# EAGLE design single44 (EAGLE 6.6.0)
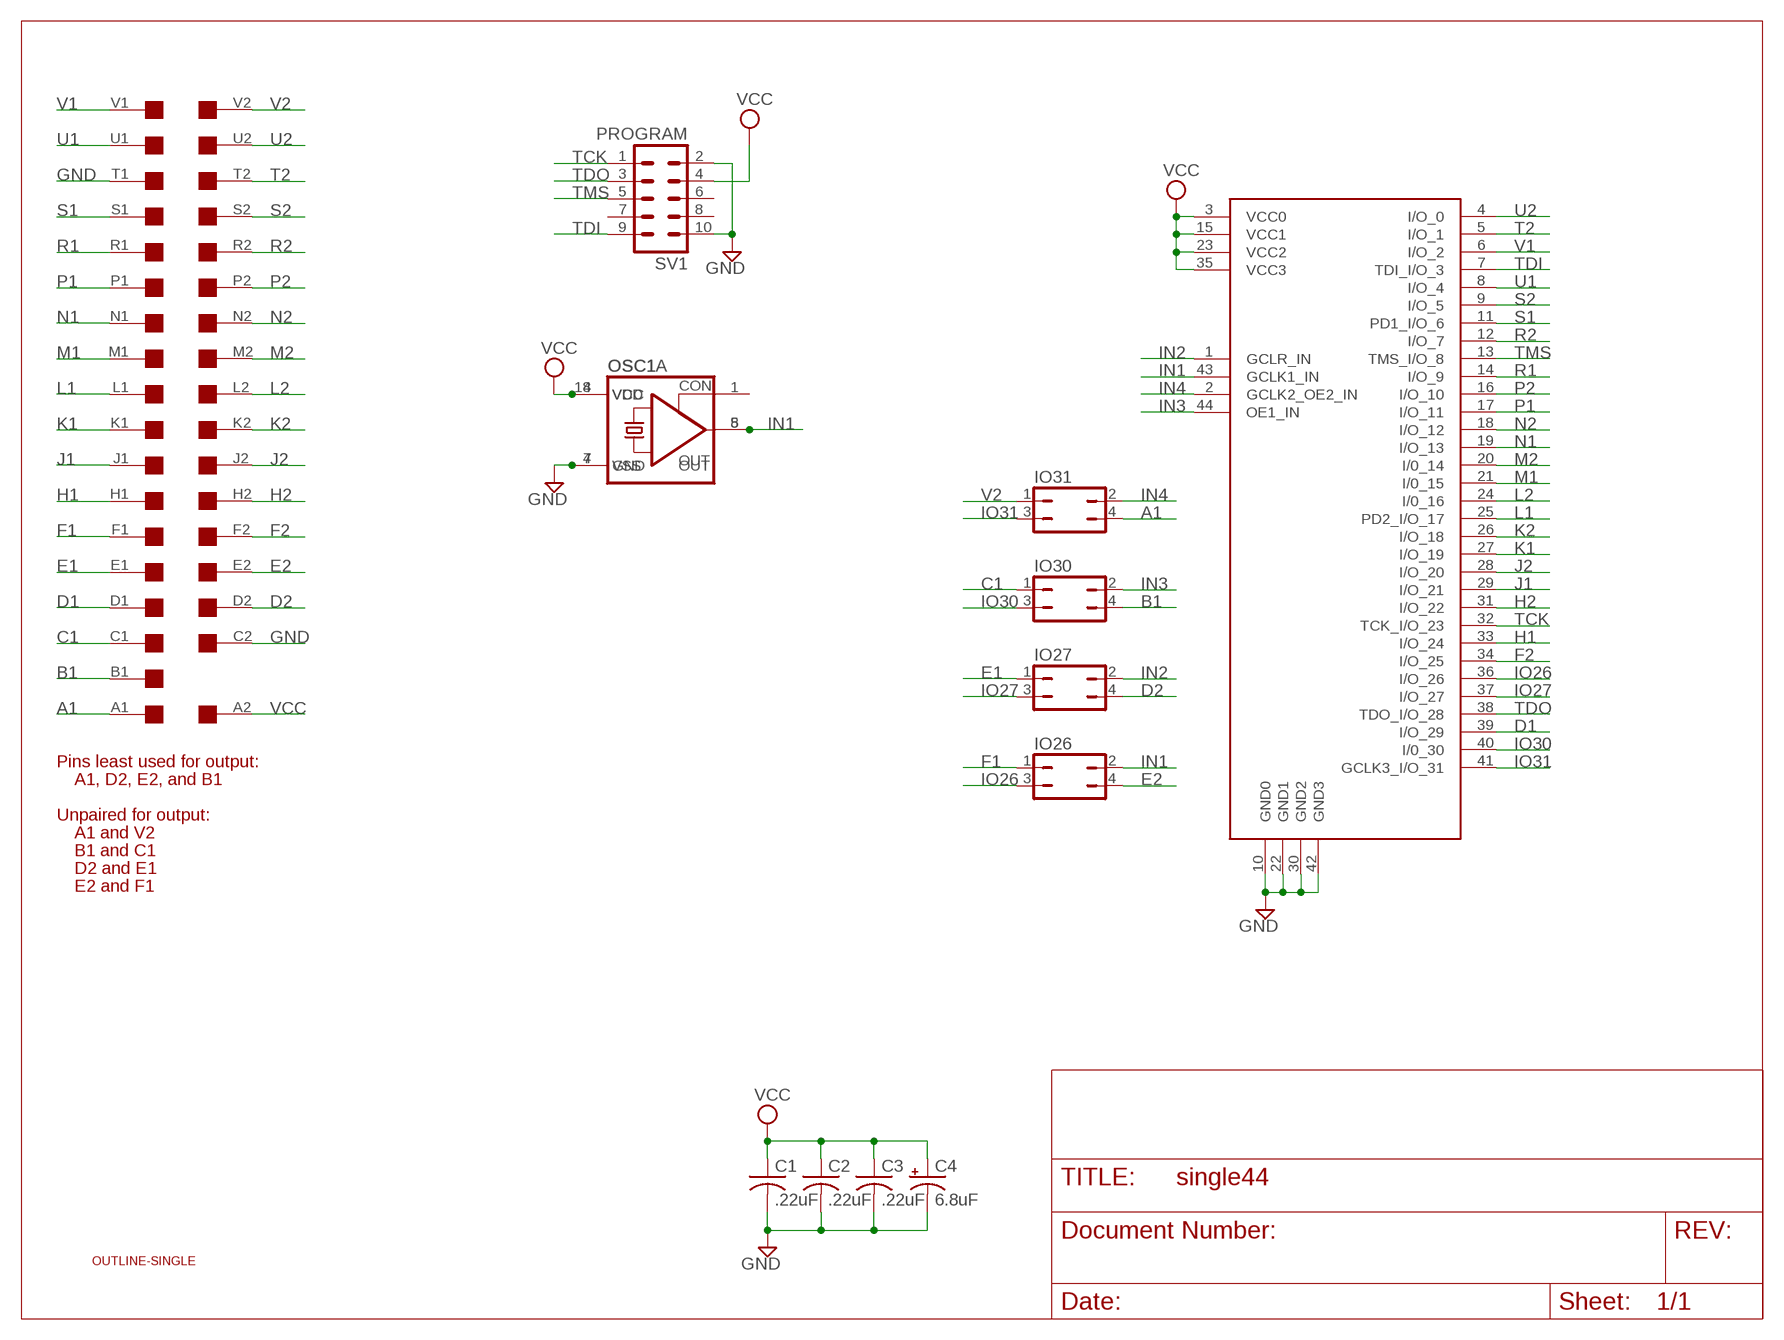
[diagram p0: schematic, sheet 1]

## Parts
C1  .22uF  C-US050-025X075  [C050-025X075]
C2  .22uF  C-US050-025X075  [C050-025X075]
C3  .22uF  C-US050-025X075  [C050-025X075]
C4  6.8uF  CPOL-USE15-5AXIAL  [E15-5]
IO26  JP2Q  [JP2Q]
IO27  JP2Q  [JP2Q]
IO30  JP2Q  [JP2Q]
IO31  JP2Q  [JP2Q]
OSC1  QG5460  [DIL08S]
OSC1A  CRYSTAL_RES-SG51  [SG51]
SV1  PROGRAM  ML10  [ML10]
U1  ATF1504  ATF1502PLCC44  [3M44]
U$1  OUTLINE-SINGLE  [SINGLE]
U$2  SINGLE  [EDGE-CON2]

## Nets
A1: IO31.4 U$2.A1
B1: IO30.4 U$2.B1
C1: IO30.1 U$2.C1
D1: U1.39(I/O_29) U$2.D1
D2: IO27.4 U$2.D2
E1: IO27.1 U$2.E1
E2: IO26.4 U$2.E2
F1: IO26.1 U$2.F1
F2: U1.34(I/O_25) U$2.F2
GND: C1.2 C2.2 C3.2 C4.- OSC1.4(GND) OSC1A.7(VSS) SV1.2 SV1.10 U1.10(GND0) U1.22(GND1) U1.30(GND2) U1.42(GND3) U$2.C2 U$2.T1
H1: U1.33(I/O_24) U$2.H1
H2: U1.31(I/O_22) U$2.H2
IN1: IO26.2 OSC1.5(OUT) OSC1A.8(OUT) U1.43(GCLK1_IN)
IN2: IO27.2 U1.1(GCLR_IN)
IN3: IO30.2 U1.44(OE1_IN)
IN4: IO31.2 U1.2(GCLK2_OE2_IN)
IO26: IO26.3 U1.36(I/O_26)
IO27: IO27.3 U1.37(I/O_27)
IO30: IO30.3 U1.40(I/0_30)
IO31: IO31.3 U1.41(GCLK3_I/O_31)
J1: U1.29(I/O_21) U$2.J1
J2: U1.28(I/O_20) U$2.J2
K1: U1.27(I/O_19) U$2.K1
K2: U1.26(I/O_18) U$2.K2
L1: U1.25(PD2_I/O_17) U$2.L1
L2: U1.24(I/0_16) U$2.L2
M1: U1.21(I/0_15) U$2.M1
M2: U1.20(I/0_14) U$2.M2
N1: U1.19(I/O_13) U$2.N1
N2: U1.18(I/O_12) U$2.N2
P1: U1.17(I/O_11) U$2.P1
P2: U1.16(I/O_10) U$2.P2
R1: U1.14(I/O_9) U$2.R1
R2: U1.12(I/O_7) U$2.R2
S1: U1.11(PD1_I/O_6) U$2.S1
S2: U1.9(I/O_5) U$2.S2
T2: U1.5(I/O_1) U$2.T2
TCK: SV1.1 U1.32(TCK_I/O_23)
TDI: SV1.9 U1.7(TDI_I/O_3)
TDO: SV1.3 U1.38(TDO_I/O_28)
TMS: SV1.5 U1.13(TMS_I/O_8)
U1: U1.8(I/O_4) U$2.U1
U2: U1.4(I/O_0) U$2.U2
V1: U1.6(I/O_2) U$2.V1
V2: IO31.1 U$2.V2
VCC: C1.1 C2.1 C3.1 C4.+ OSC1.8(VCC) OSC1A.14(VDD) SV1.4 U1.3(VCC0) U1.15(VCC1) U1.23(VCC2) U1.35(VCC3) U$2.A2
Unconnected: OSC1A.1(CON) SV1.6 SV1.7 SV1.8 U$2.B2

## Notes on the sheet
- Pins least used for output:
- A1, D2, E2, and B1
- Unpaired for output:
- A1 and V2
- B1 and C1
- D2 and E1
- E2 and F1

## Library data of the parts
C1-C3 = rcl:C-US: CAPACITOR, American symbol
C4 = dec-con:CPOL-USE15-5AXIAL: 0.6" version of an electrolytic
IO26 IO27 IO30 IO31 = jumper:JP2Q: JUMPER
OSC1 = crystal:QG5460: CRYSTAL RESONATOR; OC_FARNELL: unknown; OC_NEWARK: unknown
OSC1A = crystal:CRYSTAL_RES-: CRYSTAL RESONATOR; OC_FARNELL: unknown; OC_NEWARK: unknown
SV1 = con-harting-ml:ML10: HARTING; OC_FARNELL: unknown; OC_NEWARK: unknown
U1 = atmel-cpld:ATF1502: ATF150x in 44 pin package.
U$1 = dec-con:OUTLINE-*: Board outlines for DEC boards.
U$2 = dec-con:SINGLE: Single-Height DEC board

## Net classes
1 Supply: width 0.711 mm

## Board
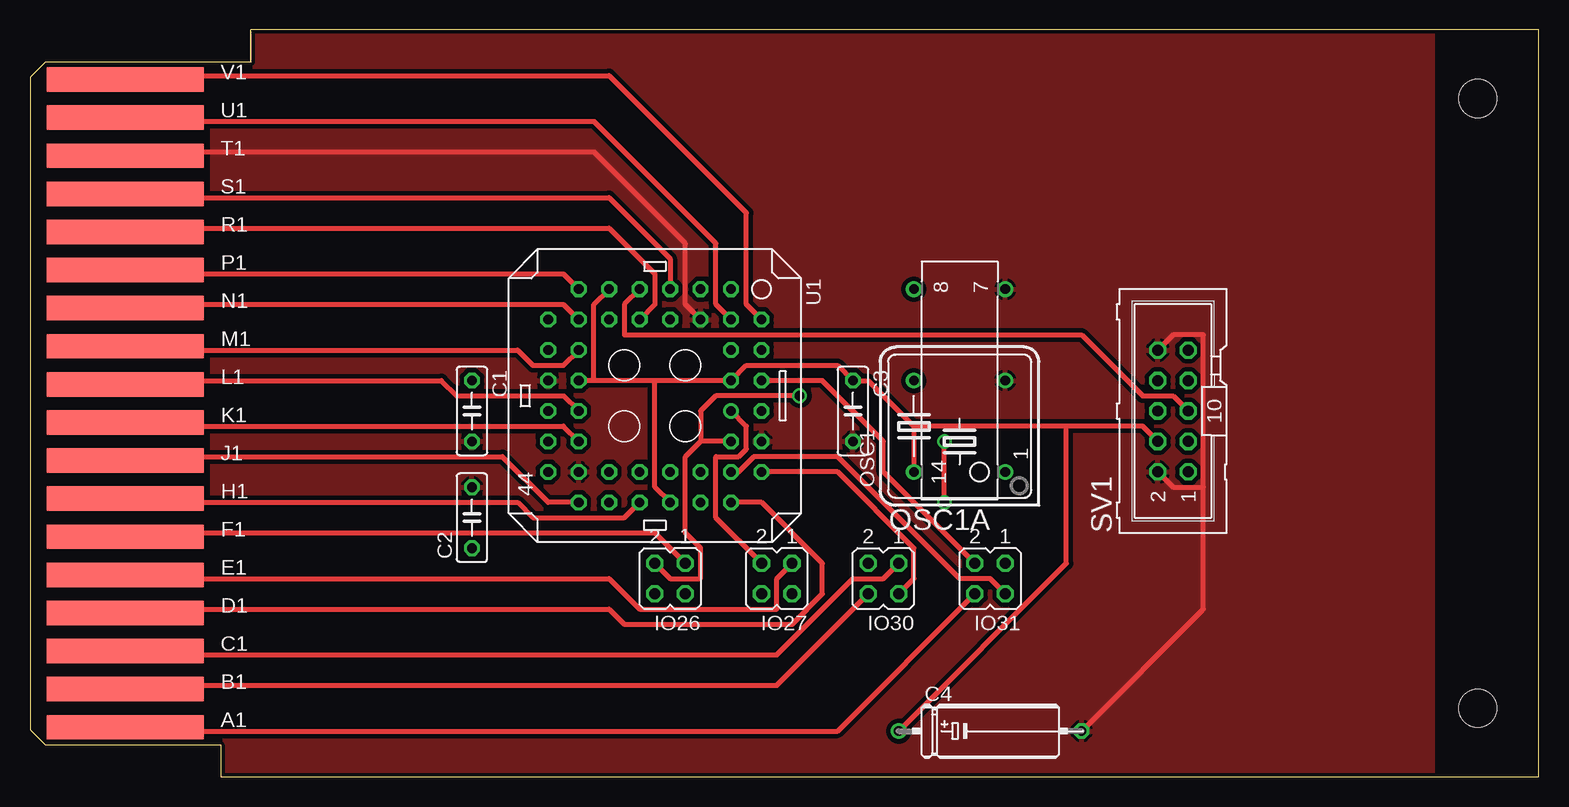
[diagram p1: board, top side]
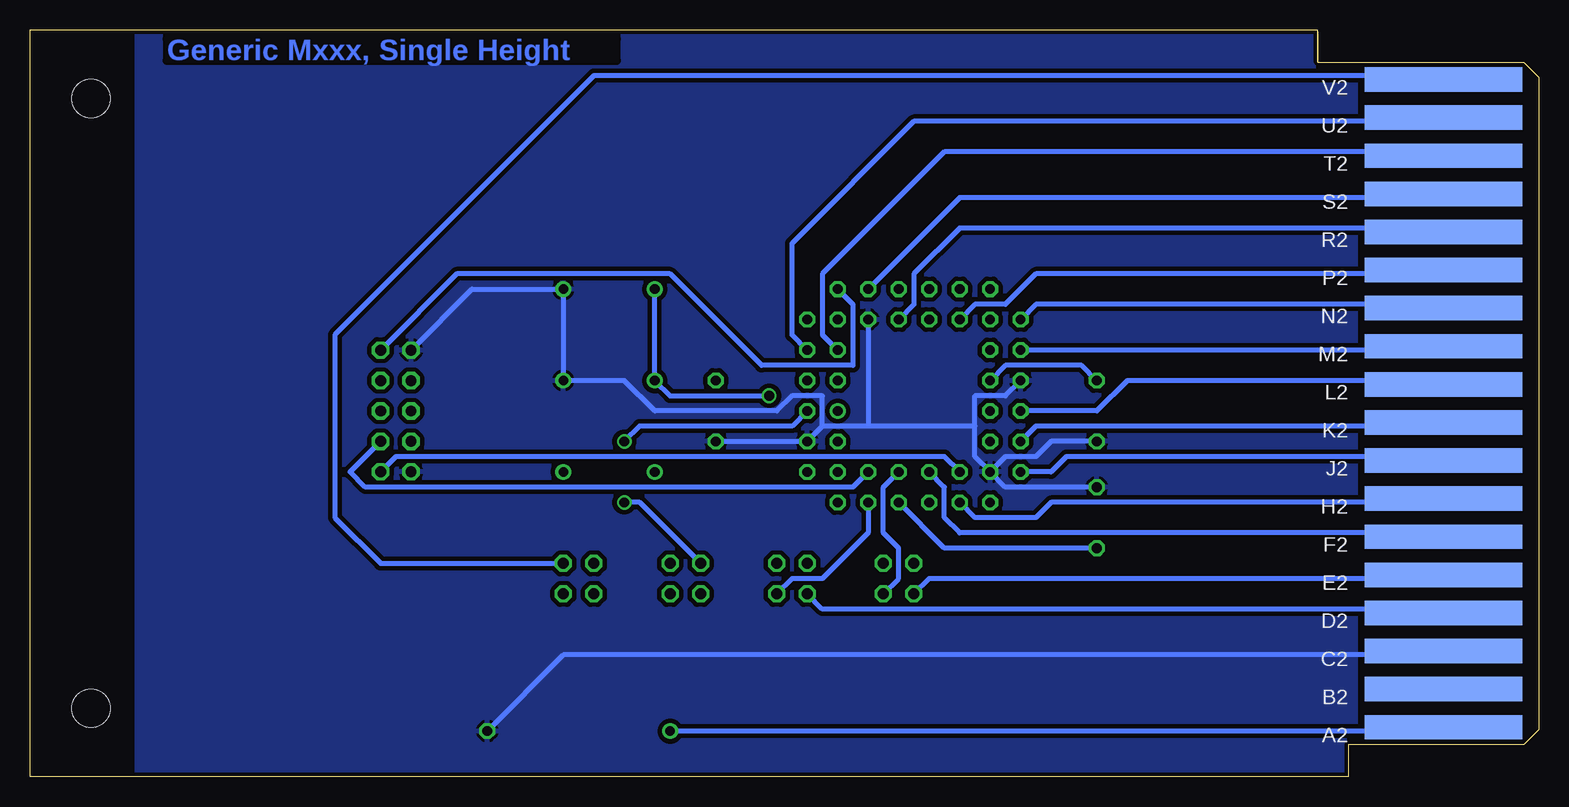
[diagram p2: board, bottom side, seen from below]

Size 125.73 x 62.23 mm. Coordinates in mm from the lower left corner, seen from the top.
Copper layers (1+16): Top 0.035mm / dielectric 1.5mm / Bottom 0.035mm
Design rules "16mils": minimum track width 16mil, minimum drill 32mil, track to track 15mil, track to pad 10mil, pad to pad 10mil, via to via 10mil, smd to smd 10mil, copper to edge 13mil, drill to drill 10mil, minimum pad ring 10mil, minimum via ring 8mil, stop-mask expansion 0mil, vias tented up to drill 0mil, thermal gap 10mil

### Footprints (pad centres in the part's own frame; a part is rotated, then mirrored left to right if it is on the bottom)
C050-025X075 = drill 0.813 octagon: 1 -2.54,0; 2 2.54,0
E15-5 = drill 0.813: + -7.62,0 | drill 0.813 octagon: - 7.62,0
JP2Q = drill 0.914 octagon: 1 -1.27,-1.27; 2 1.27,-1.27; 3 -1.27,1.27; 4 1.27,1.27
DIL08S = drill 0.813: 1 -3.81,-3.81; 4 3.81,-3.81; 5 3.81,3.81; 8 -3.81,3.81
SG51 = drill 0.813: 1 -7.62,-3.81; 7 7.62,-3.81; 8 7.62,3.81; 14 -7.62,3.81
ML10 = drill 0.914 octagon: 1 -5.08,-1.27; 2 -5.08,1.27; 3 -2.54,-1.27; 4 -2.54,1.27; 5 0,-1.27; 6 0,1.27; 7 2.54,-1.27; 8 2.54,1.27; 9 5.08,-1.27; 10 5.08,1.27
3M44 = drill 0.813: 1 1.27,6.35 | drill 0.813 octagon: 2 -1.27,8.89; 3 -1.27,6.35; 4 -3.81,8.89; 5 -3.81,6.35; 6 -6.35,8.89; 7 -8.89,6.35; 8 -6.35,6.35; 9 -8.89,3.81; 10 -6.35,3.81; 11 -8.89,1.27; 12 -6.35,1.27; 13 -8.89,-1.27; 14 -6.35,-1.27; 15 -8.89,-3.81; 16 -6.35,-3.81; 17 -8.89,-6.35; 18 -6.35,-8.89; 19 -6.35,-6.35; 20 -3.81,-8.89; 21 -3.81,-6.35; 22 -1.27,-8.89; 23 -1.27,-6.35; 24 1.27,-8.89; 25 1.27,-6.35; 26 3.81,-8.89; 27 3.81,-6.35; 28 6.35,-8.89; 29 8.89,-6.35; 30 6.35,-6.35; 31 8.89,-3.81; 32 6.35,-3.81; 33 8.89,-1.27; 34 6.35,-1.27; 35 8.89,1.27; 36 6.35,1.27; 37 8.89,3.81; 38 6.35,3.81; 39 8.89,6.35; 40 6.35,8.89; 41 6.35,6.35; 42 3.81,8.89; 43 3.81,6.35; 44 1.27,8.89
SINGLE = hole 3.175: 120.65,56.515; 120.65,5.715
EDGE-CON2 = smd 13.106 x 2.032: A1 7.938,4.128; B1 7.938,7.303; C1 7.938,10.477; D1 7.938,13.652; E1 7.938,16.828; F1 7.938,20.003; H1 7.938,23.177; J1 7.938,26.352; K1 7.938,29.527; L1 7.938,32.703; M1 7.938,35.877; N1 7.938,39.053; P1 7.938,42.227; R1 7.938,45.403; S1 7.938,48.578; T1 7.938,51.752; U1 7.938,54.928; V1 7.938,58.102 | smd 13.106 x 2.032 bottom: A2 7.938,4.128; B2 7.938,7.303; C2 7.938,10.477; D2 7.938,13.652; E2 7.938,16.828; F2 7.938,20.003; H2 7.938,23.177; J2 7.938,26.352; K2 7.938,29.527; L2 7.938,32.703; M2 7.938,35.877; N2 7.938,39.053; P2 7.938,42.227; R2 7.938,45.403; S2 7.938,48.578; T2 7.938,51.752; U2 7.938,54.928; V2 7.938,58.102

### Placement (x,y rotation side)
C1  36.83,30.48 270 top
C2  36.83,21.59 90 top
C3  68.58,30.48 270 top
C4  80.01,3.81 0 top
IO26  53.34,16.51 180 top
IO27  62.23,16.51 180 top
IO30  71.12,16.51 180 top
IO31  80.01,16.51 180 top
OSC1  77.47,29.21 90 top
OSC1A  77.47,33.02 90 top
SV1  95.25,30.48 90 top
U1  52.07,31.75 270 top
U$1  0,0 0 top
U$2  0,0 0 top

### Tracks (layer width: path | path; a pad name or v marks a point on that pad's centre or on a via)
A1
  Top 0.406: U$2.A1 8.57,4.13 8.89,3.81 67.31,3.81 IO31.4
B1
  Top 0.406: U$2.B1 8.57,7.3 8.89,7.62 62.23,7.62 IO30.4
C1
  Top 0.406: U$2.C1 8.57,10.48 8.89,10.16 62.23,10.16 68.58,16.51 71.12,16.51 IO30.1
D1
  Top 0.406: U$2.D1 8.57,13.65 8.89,13.97 48.26,13.97 49.53,12.7 63.5,12.7 66.04,15.24 66.04,17.78 60.96,22.86 U1.39
D2
  Bottom 0.406: U$2.D2 8.57,13.65 8.89,13.97 59.69,13.97 IO27.4
E1
  Top 0.406: U$2.E1 8.26,16.51 48.26,16.51 50.8,13.97 62.23,13.97 62.23,16.51 IO27.1
E2
  Bottom 0.406: U$2.E2 8.26,16.51 50.8,16.51 IO26.4
F1
  Top 0.406: U$2.F1 7.62,20.32 52.07,20.32 IO26.1
F2
  Bottom 0.406: U$2.F2 8.26,20.32 48.26,20.32 49.53,21.59 49.53,24.13 U1.34
GND
  Top 0.406: SV1.2 95.25,24.13 97.79,24.13 | 97.79,24.13 97.79,36.83 95.25,36.83 SV1.10 | U$2.T1 8.26,52.07 46.99,52.07 54.61,44.45 54.61,39.37 U1.10 | C4.- 97.79,13.97 97.79,24.13
  Bottom 0.406: U$2.C2 8.57,10.48 8.89,10.16 81.28,10.16 C4.- | U1.22 44.45,31.75 46.99,31.75 46.99,29.21 | 46.99,29.21 55.88,29.21 | 55.88,29.21 59.69,29.21 | 59.69,29.21 U1.42 C3.2 | U1.30 46.99,26.67 46.99,29.21 | U1.10 55.88,29.21 | SV1.10 88.9,40.64 OSC1A.7 OSC1.4 76.2,33.02 73.66,30.48 63.5,30.48 62.23,31.75 59.69,31.75 59.69,29.21 | C1.2 40.64,27.94 41.91,26.67 44.45,26.67 U1.30 | C2.2 44.45,24.13 U1.30
  pour Bottom: 15.24,0 15.24,62.23 116.84,62.23 116.84,0
  pour Top: 15.24,0 15.24,62.23 116.84,62.23 116.84,0
H1
  Top 0.406: 7.62,22.86 U$2.H1 8.26,22.86 40.64,22.86 41.91,21.59 49.53,21.59 U1.33
H2
  Bottom 0.406: U$2.H2 8.26,22.86 40.64,22.86 41.91,21.59 46.99,21.59 U1.31
IN1  (via drill 0.81)
  Top 0.406: IO26.2 53.34,16.51 55.88,16.51 55.88,19.05 54.61,20.32 54.61,26.67 55.88,27.94 | U1.43 55.88,27.94 | v64.14,31.75 57.15,31.75 55.88,30.48 55.88,27.94
  Bottom 0.406: OSC1A.8 OSC1.5 72.39,31.75 v64.14,31.75
IN2
  Top 0.406: IO27.2 57.15,21.59 57.15,26.67 59.06,26.67 59.69,27.3 59.69,29.21 U1.1
IN3  (via drill 0.81)
  Top 0.406: v76.2,22.86 v76.2,27.94
  Bottom 0.406: U1.44 62.23,29.21 74.93,29.21 v76.2,27.94 | IO30.2 74.93,22.86 v76.2,22.86
IN4
  Top 0.406: IO31.2 71.12,25.4 71.12,27.94 66.04,33.02 U1.2
IO26
  Bottom 0.406: IO26.3 53.34,16.51 53.34,19.05 54.61,20.32 54.61,24.13 U1.36
IO27
  Bottom 0.406: U1.37 55.88,20.32 59.69,16.51 62.23,16.51 IO27.3
IO30
  Top 0.406: IO30.3 73.66,16.51 73.66,19.05 67.31,25.4 U1.40
IO31
  Top 0.406: IO31.3 80.01,16.51 77.47,16.51 67.31,26.67 60.33,26.67 59.06,25.4 U1.41
J1
  Top 0.406: U$2.J1 8.26,26.67 39.37,26.67 43.18,22.86 U1.29
J2
  Bottom 0.406: U$2.J2 8.26,26.67 39.37,26.67 40.64,25.4 U1.28
K1
  Top 0.406: U$2.K1 8.26,29.21 44.45,29.21 U1.27
K2
  Bottom 0.406: U$2.K2 8.26,29.21 41.91,29.21 U1.26
L1
  Top 0.406: U$2.L1 8.26,33.02 34.29,33.02 35.56,31.75 44.45,31.75 U1.25
L2
  Bottom 0.406: U$2.L2 8.26,33.02 34.29,33.02 36.83,30.48 U1.24
M1
  Top 0.406: U$2.M1 8.26,35.56 40.64,35.56 41.91,34.29 44.45,34.29 U1.21
M2
  Bottom 0.406: U$2.M2 8.26,35.56 U1.20
N1
  Top 0.406: U$2.N1 8.26,39.37 44.45,39.37 U1.19
N2
  Bottom 0.406: U$2.N2 8.26,39.37 41.91,39.37 U1.18
P1
  Top 0.406: U$2.P1 8.26,41.91 44.45,41.91 U1.17
P2
  Bottom 0.406: U$2.P2 8.26,41.91 41.91,41.91 44.45,39.37 46.99,39.37 U1.16
R1
  Top 0.406: U$2.R1 8.26,45.72 48.26,45.72 52.07,41.91 52.07,39.37 U1.14
R2
  Bottom 0.406: U$2.R2 8.26,45.72 48.26,45.72 52.07,41.91 52.07,39.37 U1.12
S1
  Top 0.406: U$2.S1 8.26,48.26 48.26,48.26 53.34,43.18 U1.11
S2
  Bottom 0.406: U$2.S2 8.26,48.26 48.26,48.26 U1.9
T2
  Bottom 0.406: U$2.T2 8.26,52.07 49.53,52.07 59.69,41.91 59.69,36.83 U1.5
TCK
  Bottom 0.406: U1.32 49.53,26.67 95.25,26.67 SV1.1
TDI
  Bottom 0.406: U1.7 57.15,39.37 57.15,34.29 64.77,34.29 72.39,41.91 90.17,41.91 SV1.9
TDO
  Bottom 0.406: U1.38 57.15,24.13 97.79,24.13 99.06,25.4 SV1.3
TMS
  Top 0.406: U1.13 49.53,39.37 49.53,36.83 87.63,36.83 92.71,31.75 95.25,31.75 SV1.5
U1
  Top 0.406: U$2.U1 8.26,54.61 46.99,54.61 57.15,44.45 57.15,39.37 U1.8
U2
  Bottom 0.406: U$2.U2 8.26,54.61 52.07,54.61 62.23,44.45 62.23,36.83 U1.4
V1
  Top 0.406: U$2.V1 8.26,58.42 48.26,58.42 59.69,46.99 59.69,39.37 U1.6
V2
  Bottom 0.406: U$2.V2 8.26,58.42 78.74,58.42 100.33,36.83 100.33,21.59 96.52,17.78 IO31.1
VCC
  Top 0.406: 46.99,33.02 46.99,39.37 U1.15 | 52.07,33.02 U1.3 59.69,34.29 67.31,34.29 C3.1 69.85,33.02 73.66,29.21 | 52.07,33.02 46.99,33.02 | 46.99,33.02 U1.23 | U1.35 52.07,24.13 52.07,33.02 | 73.66,29.21 OSC1.8 | SV1.4 92.71,29.21 86.36,29.21 | 86.36,29.21 73.66,29.21 | C4.+ 86.36,17.78 86.36,29.21
  Bottom 0.406: U$2.A2 7.62,3.81 C4.+ | C1.1 38.1,34.29 44.45,34.29 U1.23 | C2.1 49.53,19.05 U1.35

### Text on the board
Bottom: Generic Mxxx, Single Height